# Altium schematic sheet Power.SchDoc
size 241 x 215 mm
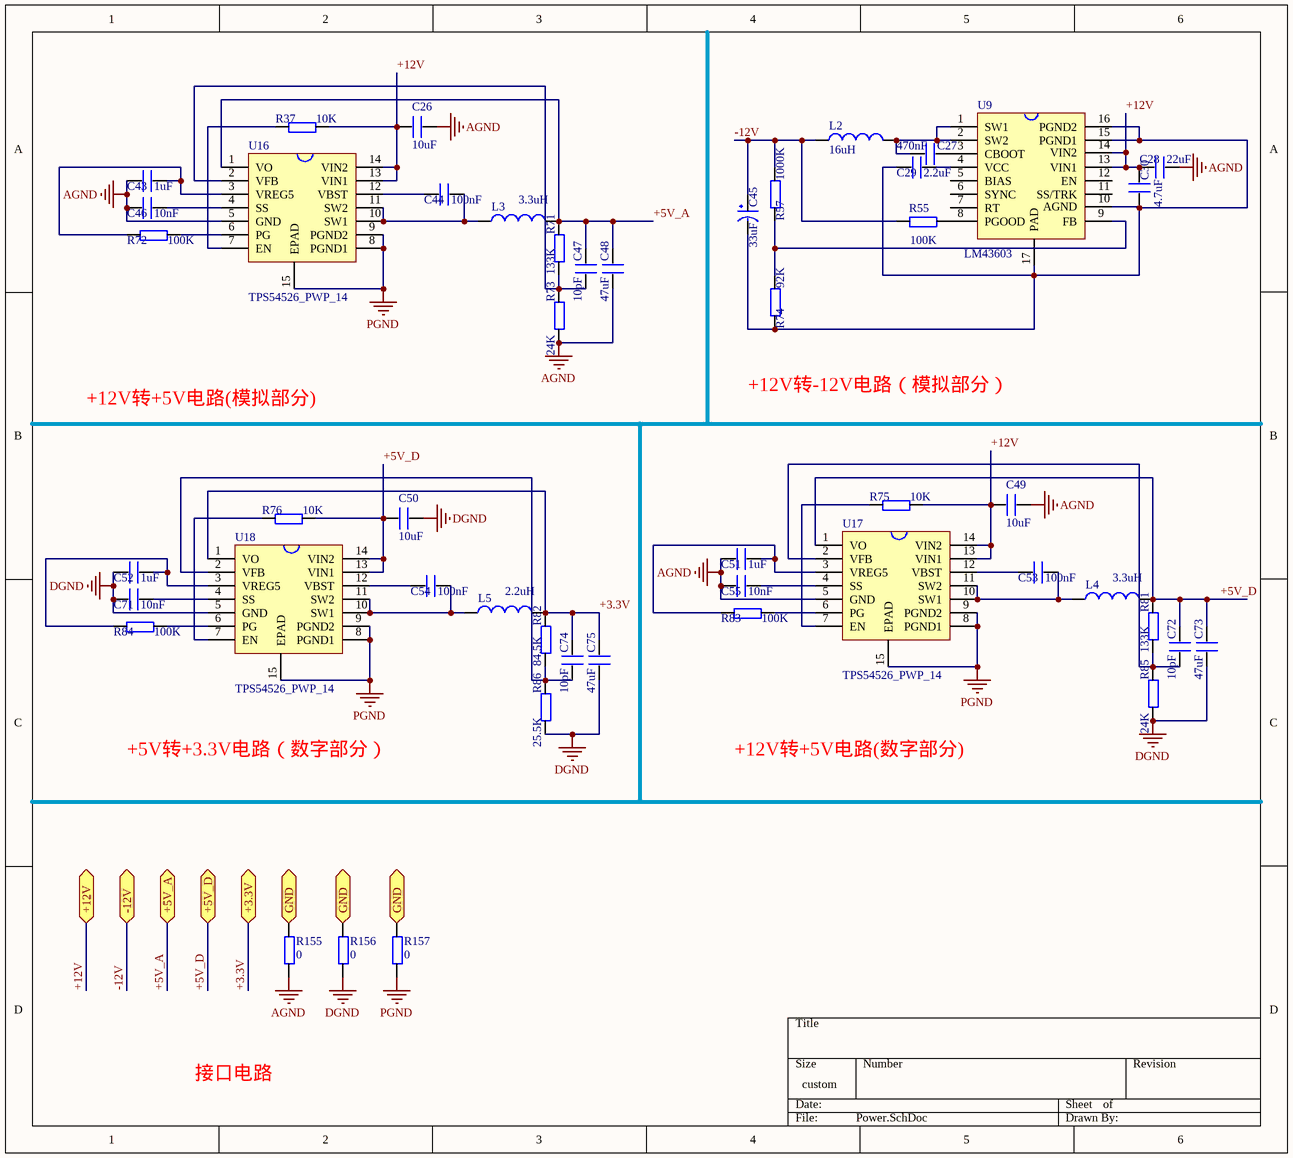
[diagram p0: Power.SchDoc]

## Parts
C26  10uF  [0603P]
C27  470nF  [0603P]
C28  22uF  [0603P]
C29  2.2uF  [0603P]
C30  4.7uF  [0603P]
C43  1uF  [0603P]
C44  100nF  [0603P]
C45  33uF  [CC6.56.5]
C46  10nF  [0603P]
C47  10pF  [0603P]
C48  47uF  [0603P]
C49  10uF  [0603P]
C50  10uF  [0603P]
C51  1uF  [0603P]
C52  1uF  [0603P]
C53  100nF  [0603P]
C54  100nF  [0603P]
C55  10nF  [0603P]
C71  10nF  [0603P]
C72  10pF  [0603P]
C73  47uF  [0603P]
C74  10pF  [0603P]
C75  47uF  [0603P]
L2  value 16uH  [0402-A]  (hidden comment: Inductor)
L3  value 3.3uH  [0402-A]  (hidden comment: Inductor)
L4  value 3.3uH  [0402-A]  (hidden comment: Inductor)
L5  value 2.2uH  [0402-A]  (hidden comment: Inductor)
R37  10K  [0603P]
R55  100K  [0603P]
R57  1000K  [0603P]
R71  133K  [0603P]
R72  100K  [0603P]
R73  24K  [0603P]
R74  92K  [0603P]
R75  10K  [0603P]
R76  10K  [0603P]
R81  133K  [0603P]
R82  84.5K  [0603P]
R83  100K  [0603P]
R84  100K  [0603P]
R85  24K  [0603P]
R86  25.5K  [0603P]
R155  0  [0603P]
R156  0  [0603P]
R157  0  [0603P]
U9  LM43603
U16  TPS54526_PWP_14  [HTSSOP]
U17  TPS54526_PWP_14  [HTSSOP]
U18  TPS54526_PWP_14  [HTSSOP]

## Ports
+3.3V, +5V_A, +5V_D, +12V, -12V, GND

## Nets
AGND: C26.2 C28.2 C43.1 C46.1 C48.1 C49.2 C51.1 C55.1 R73.1 R155.1 U16.5(GND) U17.5(GND)
DGND: C50.2 C52.1 C71.1 C73.1 C75.1 R85.1 R86.1 R156.1 U18.5(GND)
PGND: R157.1 U16.8(PGND1) U16.9(PGND2) U16.15(EPAD) U17.8(PGND1) U17.9(PGND2) U17.15(EPAD) U18.8(PGND1) U18.9(PGND2) U18.15(EPAD)
+3.3V: C74.2 C75.2 L5.2 R82.2 U18.1(VO) ; port +3.3V
+5V_A: C47.2 C48.2 L3.2 R71.2 U16.1(VO) ; port +5V_A
+5V_D: C50.1 C72.2 C73.2 L4.2 R76.2 R81.2 U17.1(VO) U18.13(VIN1) U18.14(VIN2) ; port +5V_D
+12V: C26.1 C28.1 C30.2 C49.1 R37.2 R75.2 U9.13(VIN1) U9.14(VIN2) U16.13(VIN1) U16.14(VIN2) U17.13(VIN1) U17.14(VIN2) ; port +12V
-12V: C45.1(VCC) L2.1 R55.1 R57.2 ; port -12V
GND: R155.2 R156.2 R157.2 ; port GND
NetC27_1: C27.1 L2.2 U9.1(SW1) U9.2(SW2)
NetC27_2: C27.2 U9.3(CBOOT)
NetC29_1: C29.1 C30.1 C45.2(GND) R74.1 U9.10(AGND) U9.15(PGND1) U9.16(PGND2) U9.17(PAD)
NetC29_2: C29.2 U9.4(VCC)
NetC43_2: C43.2 R72.1 U16.3(VREG5)
NetC44_1: C44.1 U16.12(VBST)
NetC44_2: C44.2 L3.1 U16.10(SW1) U16.11(SW2)
NetC46_2: C46.2 U16.4(SS)
NetC47_1: C47.1 R71.1 R73.2 U16.2(VFB)
NetC51_2: C51.2 R83.1 U17.3(VREG5)
NetC52_2: C52.2 R84.1 U18.3(VREG5)
NetC53_1: C53.1 U17.12(VBST)
NetC53_2: C53.2 L4.1 U17.10(SW1) U17.11(SW2)
NetC54_1: C54.1 U18.12(VBST)
NetC54_2: C54.2 L5.1 U18.10(SW1) U18.11(SW2)
NetC55_2: C55.2 U17.4(SS)
NetC71_2: C71.2 U18.4(SS)
NetC72_1: C72.1 R81.1 R85.2 U17.2(VFB)
NetC74_1: C74.1 R82.1 R86.2 U18.2(VFB)
NetR37_1: R37.1 U16.7(EN)
NetR55_2: R55.2 U9.8(PGOOD)
NetR57_1: R57.1 R74.2 U9.9(FB)
NetR72_2: R72.2 U16.6(PG)
NetR75_1: R75.1 U17.7(EN)
NetR76_1: R76.1 U18.7(EN)
NetR83_2: R83.2 U17.6(PG)
NetR84_2: R84.2 U18.6(PG)

Not connected (* = marked no-connect by the designer): U9 5(BIAS) 6(SYNC) 7(RT) 11(SS/TRK) 12(EN)

## Notes on the sheet
- +12V转+5V电路(模拟部分)
- +12V转-12V电路（模拟部分）
- +5V转+3.3V电路（数字部分）
- +12V转+5V电路(数字部分)
- 接口电路

## Library data of the parts
C26-C30 C43 C44 C46-C55 C71-C75 = C
C45 = CAP
L2-L5 = Inductor: Code_IEC: 1005; Published: 8-Jun-2000; LatestRevisionDate: 29-May-2009; LatestRevisionNote: IPC-7351 Footprint Added.; PackageReference: 0402-A; Publisher: Altium Limited; PackageDescription: Chip Inductor; Code_JEITA: 0402
R37 R55 R57 R71-R76 R81-R86 R155-R157 = R
U16-U18 = TPS54526